# EAGLE schematic envelope_detector (EAGLE 9.6.2)
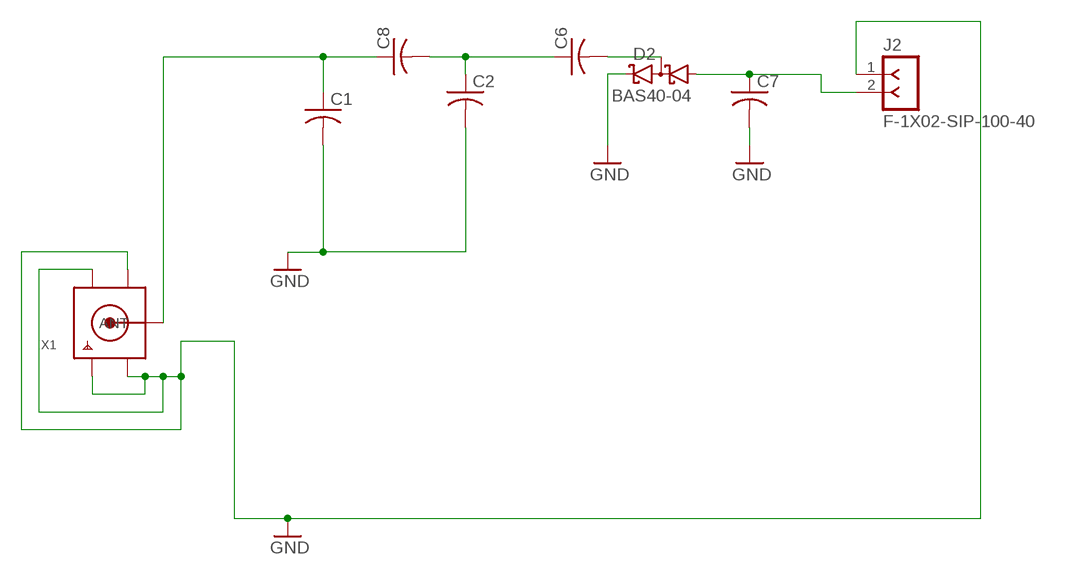
[diagram p0: schematic, sheet 1]

## Parts
C1  C-USC0805  [C0805]
C2  C-USC0805  [C0805]
C6  C-USC0805  [C0805]
C7  C-USC0805  [C0805]
C8  C-USC0805  [C0805]
D2  BAS40-04  [SOT23]
J2  F-1X02-SIP-100-40  [SIP-100-02-40]
X1  SMACONNECTOR_EDGE  [SMA_EDGELAUNCH]

## Nets
GND: C1.2 C2.2 C7.2 D2.2(C2) J2.1 X1.GND@1(GND4) X1.GND@2(GND3) X1.GND@3(GND2) X1.GND@4(GND1)
N$1: C7.1 D2.1(A1) J2.2
N$7: C6.2 D2.3(C1A2)
N$10: C1.1 C8.1 X1.P(ANT)
N$11: C2.1 C6.1 C8.2

## Library data of the parts
C1 C2 C6-C8 = adafruit:C-US: CAPACITOR, American symbol
D2 = diode:BAS40-04: Silicon Schottky Diodes General-purpose diode for high-speed switching
J2 = con-headers-jp:F-1X02-: FEMALE HEADER
X1 = adafruit:SMACONNECTOR: SMA Connector 90° DIP SMA Connector, 50 Ohm (4UConnector: 07259)